# Altium schematic sheet schematic.SchDoc
size C; SheetNumber: 1; SheetTotal: 1; SPICEModelCacheNLUUPGOY: <root> / <DocumentId>NLUUPGOY</DocumentId> / <CacheFrame Number="0"> / <Model Name="umk107bj105_a-t" Kind="CKT"> / <Text>* UMK107BJ105_A-T     SPICE MODEL  ( General Type ) / *-------------------------------------------------------------------------------------------------------- / * Model Generated by TAIYO YUDEN Corporation (http://www.ty-top.com) / * Version 1.0 / * TAIYO YUDEN Control No. 170508_130520 / * Copyright(c) 2012 TAIYO YUDEN CO.,LTD. All Rights Reserved. / *-------------------------------------------------------------------------------------------------------- / * / * Products Name : Multilayer Ceramic Capacitors / * / * Characteristics : / *     Capacitance : 1 uF , Rated Voltage : 50V , TCC : X5R / *     Case Size : 1.6 x 0.8 / 0.063 x 0.031 [mm/inch] , Thickness : 0.8 / 0.031 [mm/inch] / *     (Conditions: Temperature = 25 degC , DC Bias Current/Voltage = 0A / 0V) / * / * Frequency Range : 40Hz - 3GHz / * / * External Node Assignments : / * / *  1  o---| |---o  2 / * / *-------------------------------------------------------------------------------------------------------- / .SubCkt UMK107BJ105_A-T 1 2 / **************************** / C0 1 110 0.79929u / Cm 1 101 0.13681u / C1 101 102 0.26224u / Rc1 101 102 5.8806k / C2 102 103 0.057839u / Rc2 102 103 469.42 / C3 103 110 0.014568u / Rc3 103 110 14.853 / C2m 1 301 0.13283u / C21 301 302 1.2593u / Rc21 301 302 6.3079k / C22 302 303 1.1189u / Rc22 302 303 6.9405k / C23 303 304 1.1421u / Rc23 303 304 6.4848k / C24 304 305 0.36861u / Rc24 304 305 785 / C25 305 306 0.39327u / Rc25 305 306 637.41 / C26 306 307 0.27451u / Rc26 306 307 19.365 / C27 307 308 0.15295u / Rc27 307 308 23.239 / C28 308 309 0.17569u / Rc28 308 309 17.788 / C29 309 110 1420.6p / Rc29 309 110 1.9725 / Rp0 1 110 500Meg / L0 110 120 0.24088n / Lm 120 130 0.1369n / L1 120 121 0.1842n / RL1 121 130 0.29804 / L2 120 122 0.40657n / RL2 122 130 0.57395 / L3 120 123 0.85773n / RL3 123 130 0.82282 / CR 120 124 0.11463u / LR 124 125 0.25983n / RR 125 130 52.447m / CL 130 140 1.4637p / LL 130 140 0.23986n / RL 130 140 33.985 / Rs 140 2 6.8539m / **************************** / .ends UMK107BJ105_A-T</Text> / </Model> / </CacheFrame> / </root>
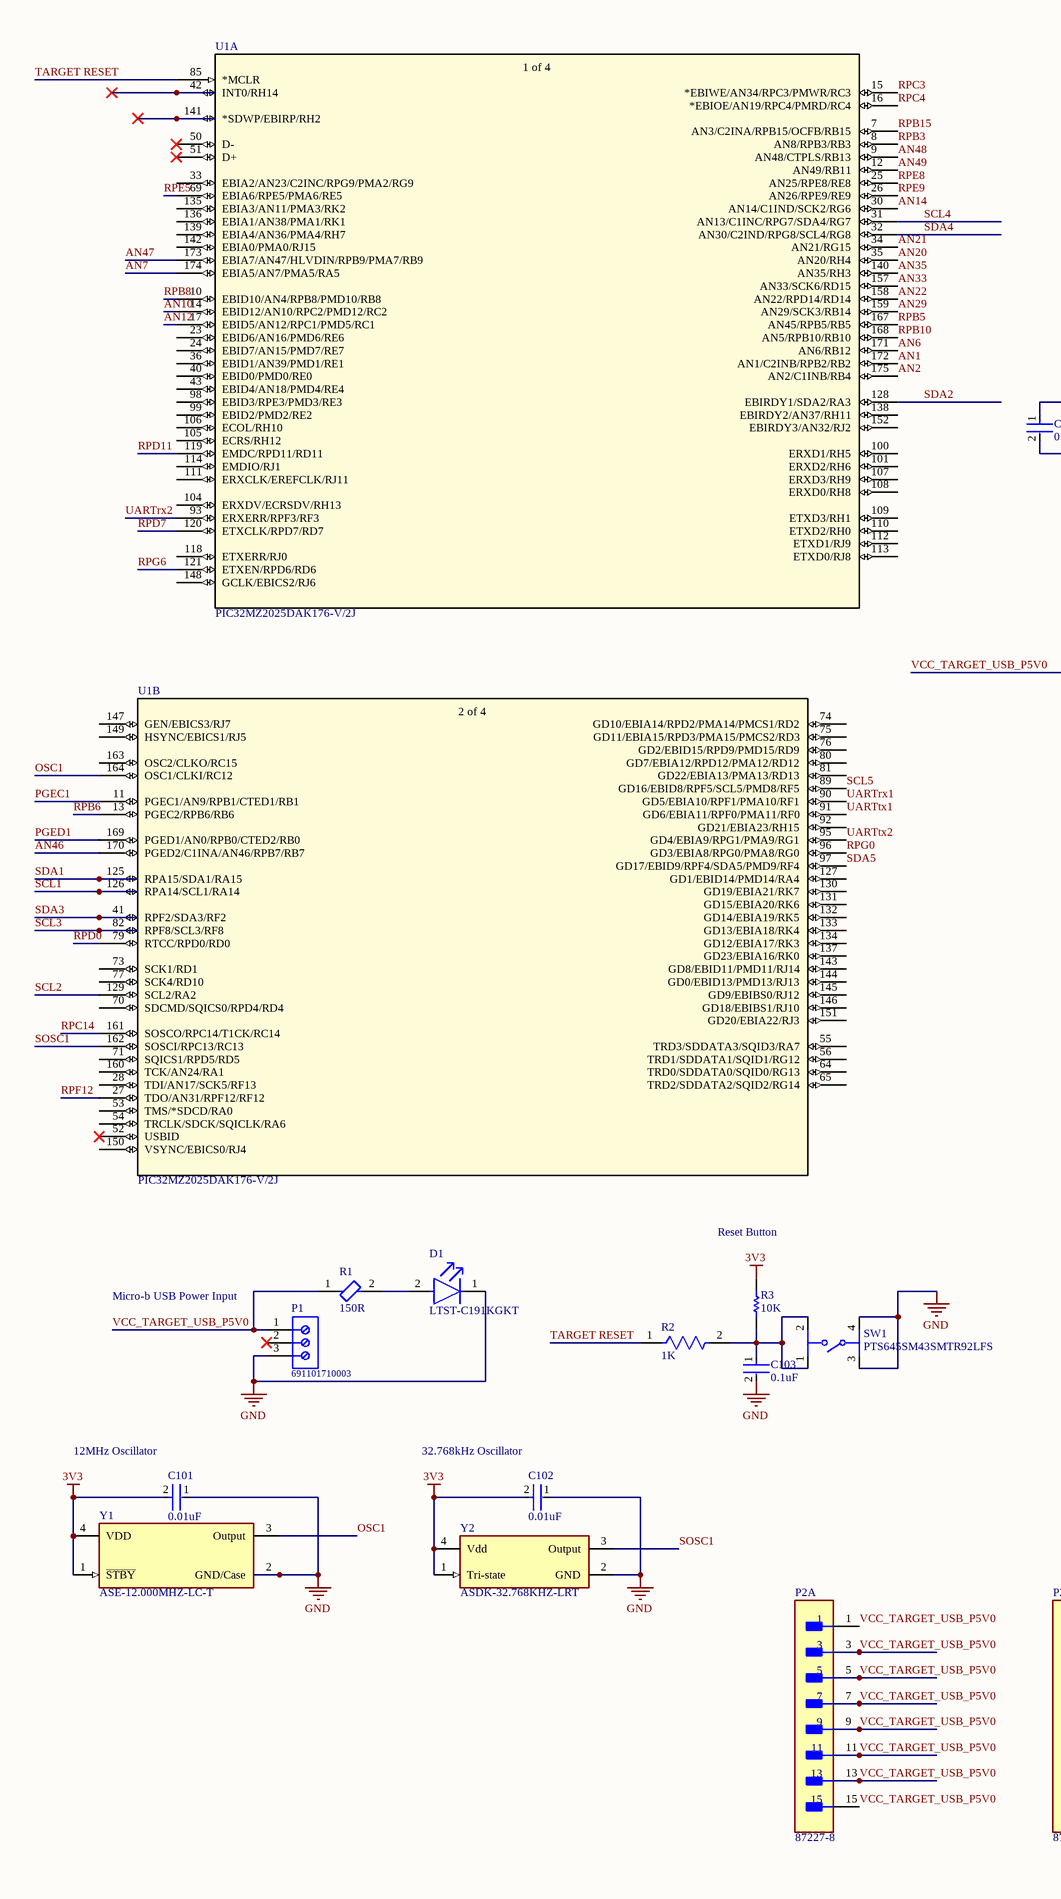
[diagram p0: schematic.SchDoc, left]
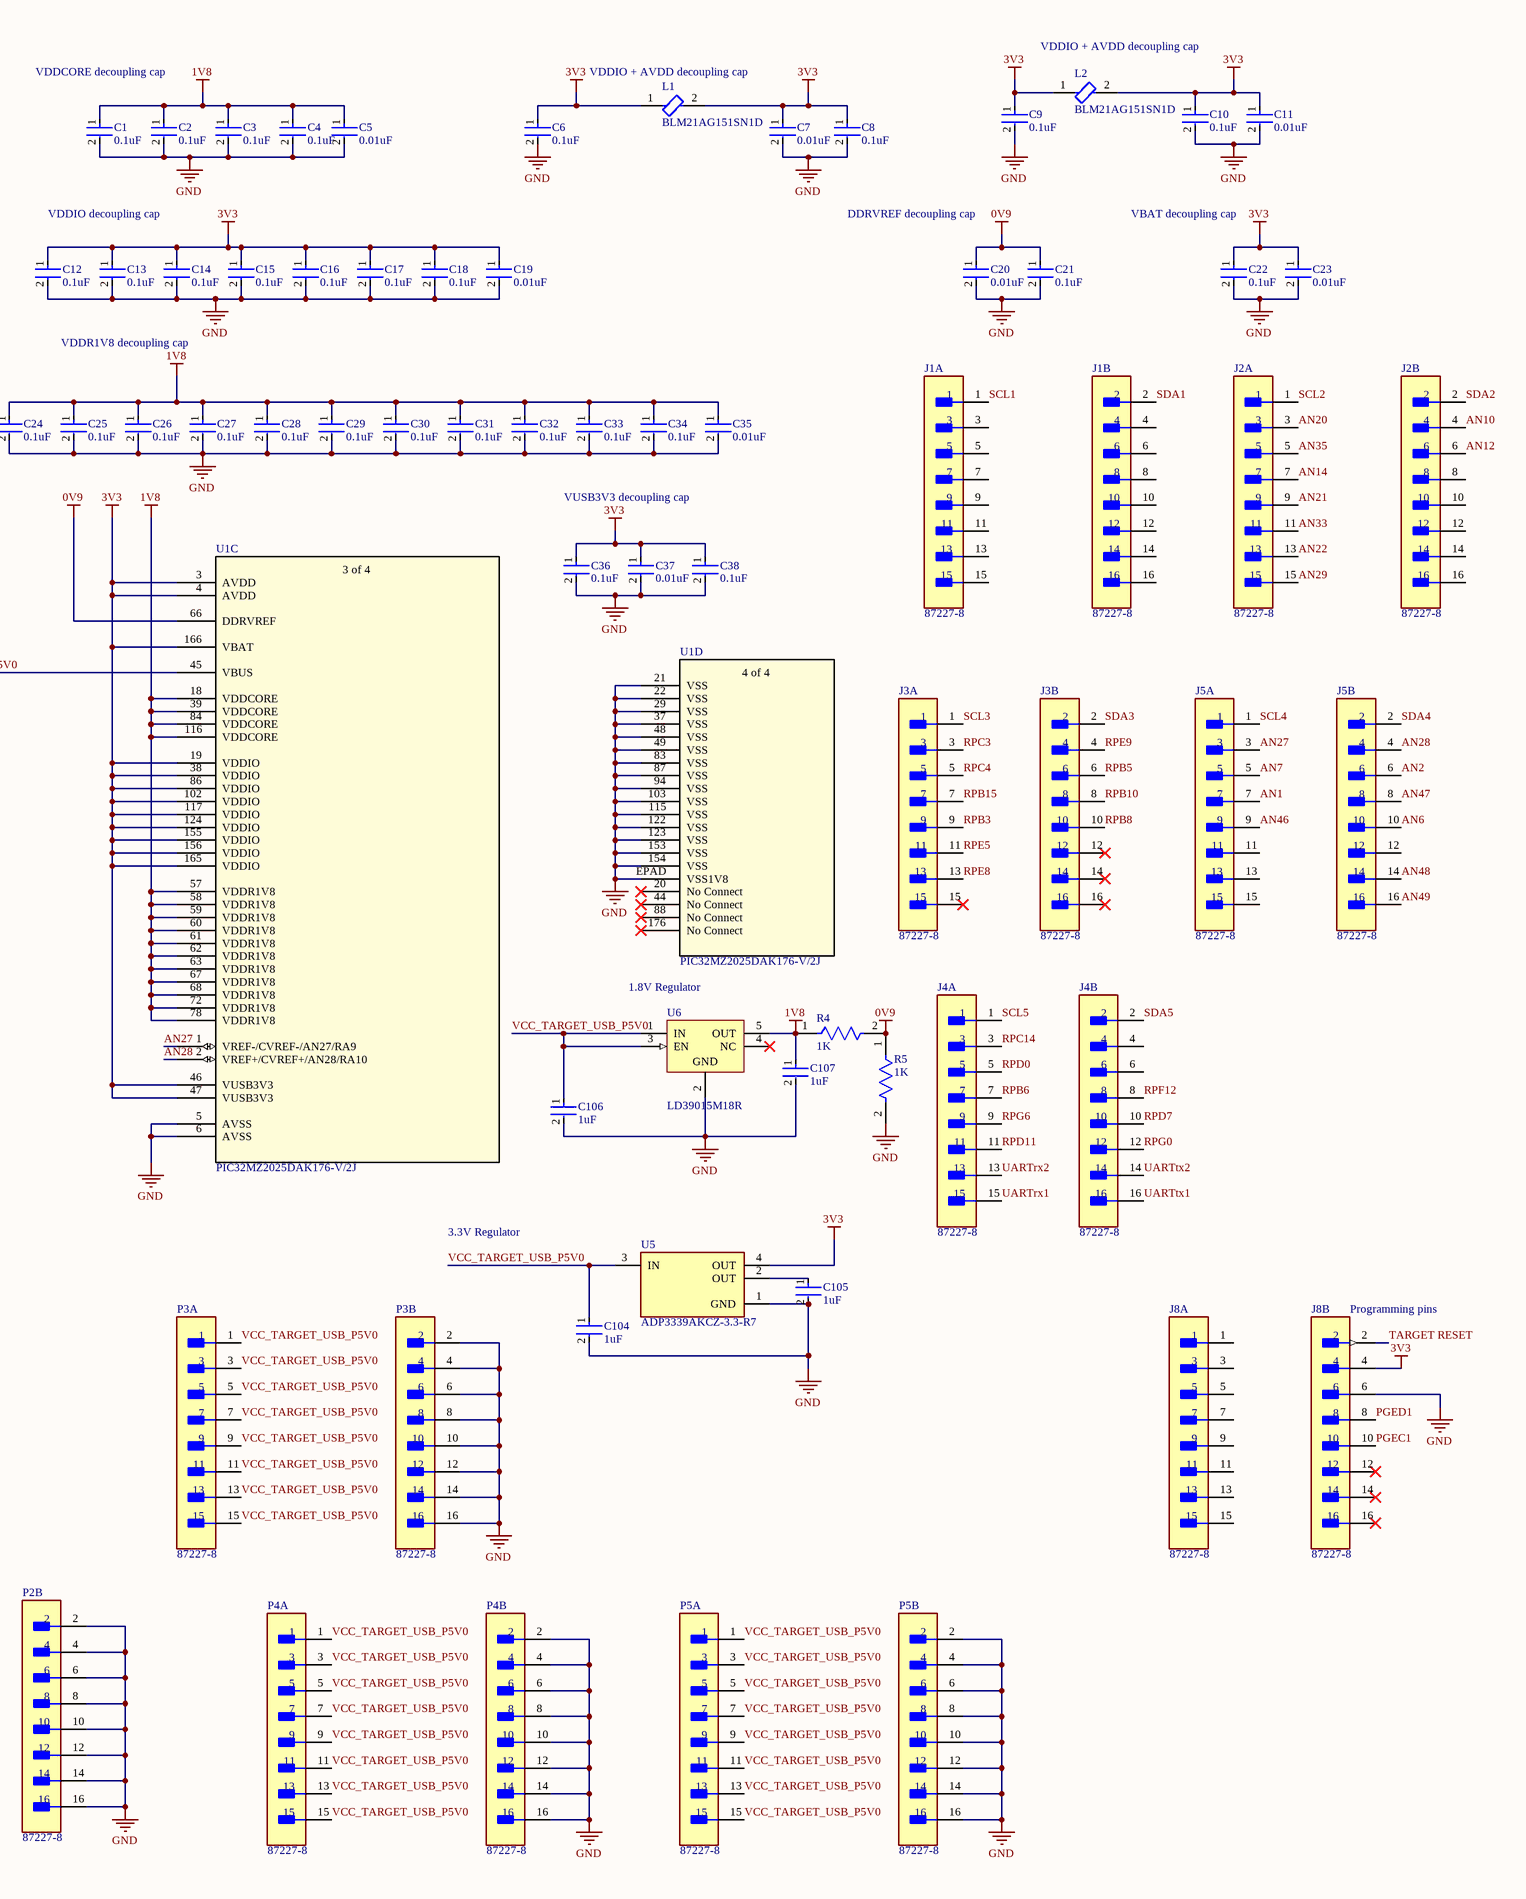
[diagram p1: schematic.SchDoc, right]

## Parts
C1  0.1uF  [FP-CGA2B-MFG]
C2  0.1uF  [FP-CGA2B-MFG]
C3  0.1uF  [FP-CGA2B-MFG]
C4  0.1uF  [FP-CGA2B-MFG]
C5  0.01uF  [FP-C1005-050-0_05-IPC_B]
C6  0.1uF  [FP-CGA2B-MFG]
C7  0.01uF  [FP-C1005-050-0_05-IPC_B]
C8  0.1uF  [FP-CGA2B-MFG]
C9  0.1uF  [FP-CGA2B-MFG]
C10  0.1uF  [FP-CGA2B-MFG]
C11  0.01uF  [FP-C1005-050-0_05-IPC_B]
C12  0.1uF  [FP-CGA2B-MFG]
C13  0.1uF  [FP-CGA2B-MFG]
C14  0.1uF  [FP-CGA2B-MFG]
C15  0.1uF  [FP-CGA2B-MFG]
C16  0.1uF  [FP-CGA2B-MFG]
C17  0.1uF  [FP-CGA2B-MFG]
C18  0.1uF  [FP-CGA2B-MFG]
C19  0.01uF  [FP-C1005-050-0_05-IPC_B]
C20  0.01uF  [FP-C1005-050-0_05-IPC_B]
C21  0.1uF  [FP-CGA2B-MFG]
C22  0.1uF  [FP-CGA2B-MFG]
C23  0.01uF  [FP-C1005-050-0_05-IPC_B]
C24  0.1uF  [FP-CGA2B-MFG]
C25  0.1uF  [FP-CGA2B-MFG]
C26  0.1uF  [FP-CGA2B-MFG]
C27  0.1uF  [FP-CGA2B-MFG]
C28  0.1uF  [FP-CGA2B-MFG]
C29  0.1uF  [FP-CGA2B-MFG]
C30  0.1uF  [FP-CGA2B-MFG]
C31  0.1uF  [FP-CGA2B-MFG]
C32  0.1uF  [FP-CGA2B-MFG]
C33  0.1uF  [FP-CGA2B-MFG]
C34  0.1uF  [FP-CGA2B-MFG]
C35  0.01uF  [FP-C1005-050-0_05-IPC_B]
C36  0.1uF  [FP-CGA2B-MFG]
C37  0.01uF  [FP-C1005-050-0_05-IPC_B]
C38  0.1uF  [FP-CGA2B-MFG]
C101  0.01uF  [FP-C1608-080-0_1-MFG]
C102  0.01uF  [FP-C1608-080-0_1-MFG]
C103  0.1uF  [FP-CGA3E-0_3-0_1-IPC_A]
C104  1uF  [FP-0603-L_1_6_0_1-W_0_8_0-IPC_B]
C105  1uF  [FP-0603-L_1_6_0_1-W_0_8_0-IPC_B]
C106  1uF  [FP-0603-L_1_6_0_1-W_0_8_0-IPC_B]
C107  1uF  [FP-0603-L_1_6_0_1-W_0_8_0-IPC_B]
D1  LTST-C191KGKT  [FP-LTST-C191KGKT-MFG]
J1  87227-8  [FP-87227-8-MFG]  (parts A,B of 2)
J2  87227-8  [FP-87227-8-MFG]  (parts A,B of 2)
J3  87227-8  [FP-87227-8-MFG]  (parts A,B of 2)
J4  87227-8  [FP-87227-8-MFG]  (parts A,B of 2)
J5  87227-8  [FP-87227-8-MFG]  (parts A,B of 2)
J8  87227-8  [FP-87227-8-MFG]  (parts A,B of 2)
L1  BLM21AG151SN1D  [FP-BLM21-0_2-t0_85-e0_5-MFG]
L2  BLM21AG151SN1D  [FP-BLM21-0_2-t0_85-e0_5-MFG]
P1  691101710003  [691101710003]
P2  87227-8  [FP-87227-8-MFG]  (parts A,B of 2)
P3  87227-8  [FP-87227-8-MFG]  (parts A,B of 2)
P4  87227-8  [FP-87227-8-MFG]  (parts A,B of 2)
P5  87227-8  [FP-87227-8-MFG]  (parts A,B of 2)
R1  150R  [FP-BLM18-0_15-t0_8-IPC_B]
R2  1K  [FP-ERJ3G-MFG]
R3  10K  [RESC1609X55X30LL15T15]
R4  1K  [FP-ERJ3G-MFG]
R5  1K  [FP-ERJ3G-MFG]
SW1  PTS645SM43SMTR92LFS  [FP-PTS645SM43SMTR92LFS-MFG]
U1  PIC32MZ2025DAK176-V/2J  [LQFP176_2J_MCH]  (parts A,B,C,D of 4)
U5  ADP3339AKCZ-3.3-R7  [FP-KC-3-IPC_C]
U6  LD39015M18R  [SOT23-5L_M]
Y1  ASE-12.000MHZ-LC-T  [FP-ASE-MFG]
Y2  ASDK-32.768KHZ-LRT  [FP-ASDK-MFG]

## Nets
0V9: C20.1 C21.1 R4.2 R5.1 U1.66(DDRVREF)
1V8: C1.1 C2.1 C3.1 C4.1 C5.1 C24.1 C25.1 C26.1 C27.1 C28.1 C29.1 C30.1 C31.1 C32.1 C33.1 C34.1 C35.1 C107.1 R4.1 U1.18(VDDCORE) U1.39(VDDCORE) U1.57(VDDR1V8) U1.58(VDDR1V8) U1.59(VDDR1V8) U1.60(VDDR1V8) U1.61(VDDR1V8) U1.62(VDDR1V8) U1.63(VDDR1V8) U1.67(VDDR1V8) U1.68(VDDR1V8) U1.72(VDDR1V8) U1.78(VDDR1V8) U1.84(VDDCORE) U1.116(VDDCORE) U6.5(OUT)
3V3: C6.1 C7.1 C8.1 C9.1 C10.1 C11.1 C12.1 C13.1 C14.1 C15.1 C16.1 C17.1 C18.1 C19.1 C22.1 C23.1 C36.1 C37.1 C38.1 C101.2 C102.2 J8.4 L1.1 L1.2 L2.1 L2.2 R3.2 U1.3(AVDD) U1.4(AVDD) U1.19(VDDIO) U1.38(VDDIO) U1.46(VUSB3V3) U1.47(VUSB3V3) U1.86(VDDIO) U1.102(VDDIO) U1.117(VDDIO) U1.124(VDDIO) U1.155(VDDIO) U1.156(VDDIO) U1.165(VDDIO) U1.166(VBAT) U5.4(OUT) Y1.1(~{STBY}) Y1.4(VDD) Y2.1(Tri-state) Y2.4(Vdd)
GND: C1.2 C2.2 C3.2 C4.2 C5.2 C6.2 C7.2 C8.2 C9.2 C10.2 C11.2 C12.2 C13.2 C14.2 C15.2 C16.2 C17.2 C18.2 C19.2 C20.2 C21.2 C22.2 C23.2 C24.2 C25.2 C26.2 C27.2 C28.2 C29.2 C30.2 C31.2 C32.2 C33.2 C34.2 C35.2 C36.2 C37.2 C38.2 C101.1 C102.1 C103.2 C104.2 C105.2 C106.2 C107.2 D1.1(C) J8.6 P1.3 P2.2 P2.4 P2.6 P2.8 P2.10 P2.12 P2.14 P2.16 P3.2 P3.4 P3.6 P3.8 P3.10 P3.12 P3.14 P3.16 P4.2 P4.4 P4.6 P4.8 P4.10 P4.12 P4.14 P4.16 P5.2 P5.4 P5.6 P5.8 P5.10 P5.12 P5.14 P5.16 R5.2 SW1.3 SW1.4 U1.5(AVSS) U1.6(AVSS) U1.21(VSS) U1.22(VSS) U1.29(VSS) U1.37(VSS) U1.48(VSS) U1.49(VSS) U1.83(VSS) U1.87(VSS) U1.94(VSS) U1.103(VSS) U1.115(VSS) U1.122(VSS) U1.123(VSS) U1.153(VSS) U1.154(VSS) U1.EPAD(VSS1V8) U5.1(GND) U6.2(GND) Y1.2(GND/Case) Y2.2(GND)
AN1: J5.7 U1.172(AN1/C2INB/RPB2/RB2)
AN2: J5.6 U1.175(AN2/C1INB/RB4)
AN6: J5.10 U1.171(AN6/RB12)
AN7: J5.5 U1.174(EBIA5/AN7/PMA5/RA5)
AN10: J2.4 U1.14(EBID12/AN10/RPC2/PMD12/RC2)
AN12: J2.6 U1.17(EBID5/AN12/RPC1/PMD5/RC1)
AN14: J2.7 U1.30(AN14/C1IND/SCK2/RG6)
AN20: J2.3 U1.35(AN20/RH4)
AN21: J2.9 U1.34(AN21/RG15)
AN22: J2.13 U1.158(AN22/RPD14/RD14)
AN27: J5.3 U1.1(VREF-/CVREF-/AN27/RA9)
AN28: J5.4 U1.2(VREF+/CVREF+/AN28/RA10)
AN29: J2.15 U1.159(AN29/SCK3/RB14)
AN33: J2.11 U1.157(AN33/SCK6/RD15)
AN35: J2.5 U1.140(AN35/RH3)
AN46: J5.9 U1.170(PGED2/C1INA/AN46/RPB7/RB7)
AN47: J5.8 U1.173(EBIA7/AN47/HLVDIN/RPB9/PMA7/RB9)
AN48: J5.14 U1.9(AN48/CTPLS/RB13)
AN49: J5.16 U1.12(AN49/RB11)
OSC1: U1.164(OSC1/CLKI/RC12) Y1.3(Output)
PGEC1: J8.10 U1.11(PGEC1/AN9/RPB1/CTED1/RB1)
PGED1: J8.8 U1.169(PGED1/AN0/RPB0/CTED2/RB0)
RPB3: J3.9 U1.8(AN8/RPB3/RB3)
RPB5: J3.6 U1.167(AN45/RPB5/RB5)
RPB6: J4.7 U1.13(PGEC2/RPB6/RB6)
RPB8: J3.10 U1.10(EBID10/AN4/RPB8/PMD10/RB8)
RPB10: J3.8 U1.168(AN5/RPB10/RB10)
RPB15: J3.7 U1.7(AN3/C2INA/RPB15/OCFB/RB15)
RPC3: J3.3 U1.15(*EBIWE/AN34/RPC3/PMWR/RC3)
RPC4: J3.5 U1.16(*EBIOE/AN19/RPC4/PMRD/RC4)
RPC14: J4.3 U1.161(SOSCO/RPC14/T1CK/RC14)
RPD0: J4.5 U1.79(RTCC/RPD0/RD0)
RPD7: J4.10 U1.120(ETXCLK/RPD7/RD7)
RPD11: J4.11 U1.119(EMDC/RPD11/RD11)
RPE5: J3.11 U1.69(EBIA6/RPE5/PMA6/RE5)
RPE8: J3.13 U1.25(AN25/RPE8/RE8)
RPE9: J3.4 U1.26(AN26/RPE9/RE9)
RPF12: J4.8 U1.27(TDO/AN31/RPF12/RF12)
RPG0: J4.12 U1.96(GD3/EBIA8/RPG0/PMA8/RG0)
RPG6: J4.9 U1.121(ETXEN/RPD6/RD6)
SCL1: J1.1 U1.126(RPA14/SCL1/RA14)
SCL2: J2.1 U1.129(SCL2/RA2)
SCL3: J3.1 U1.82(RPF8/SCL3/RF8)
SCL4: J5.1 U1.31(AN13/C1INC/RPG7/SDA4/RG7)
SCL5: J4.1 U1.89(GD16/EBID8/RPF5/SCL5/PMD8/RF5)
SDA1: J1.2 U1.125(RPA15/SDA1/RA15)
SDA2: J2.2 U1.128(EBIRDY1/SDA2/RA3)
SDA3: J3.2 U1.41(RPF2/SDA3/RF2)
SDA4: J5.2 U1.32(AN30/C2IND/RPG8/SCL4/RG8)
SDA5: J4.2 U1.97(GD17/EBID9/RPF4/SDA5/PMD9/RF4)
SOSC1: U1.162(SOSCI/RPC13/RC13) Y2.3(Output)
TARGET RESET: J8.2 R2.1 U1.85(*MCLR)
UARTrx1: J4.15 U1.90(GD5/EBIA10/RPF1/PMA10/RF1)
UARTrx2: J4.13 U1.93(ERXERR/RPF3/RF3)
UARTtx1: J4.16 U1.91(GD6/EBIA11/RPF0/PMA11/RF0)
UARTtx2: J4.14 U1.95(GD4/EBIA9/RPG1/PMA9/RG1)
VCC_TARGET_USB_P5V0: C104.1 C106.1 P1.1 P2.1 P2.3 P2.5 P2.7 P2.9 P2.11 P2.13 P2.15 P3.1 P3.3 P3.5 P3.7 P3.9 P3.11 P3.13 P3.15 P4.1 P4.3 P4.5 P4.7 P4.9 P4.11 P4.13 P4.15 P5.1 P5.3 P5.5 P5.7 P5.9 P5.11 P5.13 P5.15 R1.1 U1.45(VBUS) U5.3(IN) U6.1(IN) U6.3(EN)
NetC103_1: C103.1 R2.2 R3.1 SW1.1 SW1.2
NetC105_1: C105.1 U5.2(OUT)
NetD1_2: D1.2(A) R1.2

Not connected (* = marked no-connect by the designer): J1 3 4 5 6 7 8 9 10 11 12 13 14 15 16; J2 8 10 12 14 16; J3 12* 14* 15* 16*; J4 4 6; J5 11 12 13 15; J8 1 3 5 7 9 11 12* 13 14* 15 16*; P1 2*; U1 20(No_Connect)* 23(EBID6/AN16/PMD6/RE6) 24(EBID7/AN15/PMD7/RE7) 28(TDI/AN17/SCK5/RF13) 33(EBIA2/AN23/C2INC/RPG9/PMA2/RG9) 36(EBID1/AN39/PMD1/RE1) 40(EBID0/PMD0/RE0) 42(INT0/RH14)* 43(EBID4/AN18/PMD4/RE4) 44(No_Connect)* 50(D-)* 51(D+)* 52(USBID)* 53(TMS/*SDCD/RA0) 54(TRCLK/SDCK/SQICLK/RA6) 55(TRD3/SDDATA3/SQID3/RA7) 56(TRD1/SDDATA1/SQID1/RG12) 64(TRD0/SDDATA0/SQID0/RG13) 65(TRD2/SDDATA2/SQID2/RG14) 70(SDCMD/SQICS0/RPD4/RD4) 71(SQICS1/RPD5/RD5) 73(SCK1/RD1) 74(GD10/EBIA14/RPD2/PMA14/PMCS1/RD2) 75(GD11/EBIA15/RPD3/PMA15/PMCS2/RD3) 76(GD2/EBID15/RPD9/PMD15/RD9) 77(SCK4/RD10) 80(GD7/EBIA12/RPD12/PMA12/RD12) 81(GD22/EBIA13/PMA13/RD13) 88(No_Connect)* 92(GD21/EBIA23/RH15) 98(EBID3/RPE3/PMD3/RE3) 99(EBID2/PMD2/RE2) 100(ERXD1/RH5) 101(ERXD2/RH6) 104(ERXDV/ECRSDV/RH13) 105(ECRS/RH12) 106(ECOL/RH10) 107(ERXD3/RH9) 108(ERXD0/RH8) 109(ETXD3/RH1) 110(ETXD2/RH0) 111(ERXCLK/EREFCLK/RJ11) 112(ETXD1/RJ9) 113(ETXD0/RJ8) 114(EMDIO/RJ1) 118(ETXERR/RJ0) 127(GD1/EBID14/PMD14/RA4) 130(GD19/EBIA21/RK7) 131(GD15/EBIA20/RK6) 132(GD14/EBIA19/RK5) 133(GD13/EBIA18/RK4) 134(GD12/EBIA17/RK3) 135(EBIA3/AN11/PMA3/RK2) 136(EBIA1/AN38/PMA1/RK1) 137(GD23/EBIA16/RK0) 138(EBIRDY2/AN37/RH11) 139(EBIA4/AN36/PMA4/RH7) 141(*SDWP/EBIRP/RH2)* 142(EBIA0/PMA0/RJ15) 143(GD8/EBID11/PMD11/RJ14) 144(GD0/EBID13/PMD13/RJ13) 145(GD9/EBIBS0/RJ12) 146(GD18/EBIBS1/RJ10) 147(GEN/EBICS3/RJ7) 148(GCLK/EBICS2/RJ6) 149(HSYNC/EBICS1/RJ5) 150(VSYNC/EBICS0/RJ4) 151(GD20/EBIA22/RJ3) 152(EBIRDY3/AN32/RJ2) 160(TCK/AN24/RA1) 163(OSC2/CLKO/RC15) 176(No_Connect)*; U6 4(NC)*

## Notes on the sheet
- VDDCORE decoupling cap
- (near L1) VDDIO + AVDD decoupling cap
- VDDIO + AVDD decoupling cap
- VDDIO decoupling cap
- DDRVREF decoupling cap
- VBAT decoupling cap
- VDDR1V8 decoupling cap
- VUSB3V3 decoupling cap
- 1.8V Regulator
- Reset Button
- 3.3V Regulator
- Micro-b USB Power Input
- (near J8) Programming pins
- (near C101) 12MHz Oscillator
- (near C102) 32.768kHz Oscillator
- (in symbol PIC32MZ2025DAK176-V/2J, part A) 1 of 4
- (in symbol PIC32MZ2025DAK176-V/2J, part B) 2 of 4
- (in symbol PIC32MZ2025DAK176-V/2J, part C) 3 of 4
- (in symbol PIC32MZ2025DAK176-V/2J, part D) 4 of 4

## Library data of the parts
C1-C4 C6 C8-C10 C12-C18 C21 C22 C24-C34 C36 C38 = CMP-2000-05004-3: Cap Ceramic 100nF 50V X7R 10% Pad SMD 0402 +125°C Automotive T/R; Min Operating Temperature: -55°C; Packaging: Tape and Reel; Voltage Rating (DC): 50V; Package Quantity: 1; Ratings: AEC-Q200; Width: 0.02inch; Max Operating Temperature: 125°C; Weight: 2.3E-05oz; Capacitance: 100nF; Case Code (Metric): 1005; Mount: Surface Mount; Termination: SMD/SMT; REACH SVHC: No SVHC; Length: 1mm; Voltage: 50V; Voltage Rating: 50V; Case Code (Imperial): 0402; Thickness: 0.022inch; Dielectric: X7R; Lead Free: Lead Free; Depth: 0.5mm; Composition: Ceramic; Case/Package: 0402; Tolerance: 10%; Height: 0.5mm
C5 C7 C11 C19 C20 C23 C35 C37 = CMP-08246-003410-1: Multilayer Ceramic Capacitors 10nF ±20% 50V X5R SMD 0402; Voltage Rating (DC): 50V; Capacitance: 10nF; Series: C; Dielectric Material: Ceramic; Termination: SMD/SMT; Case Code (Imperial): 0402; Max Operating Temperature: 85°C; Case Code (Metric): 1005; Weight: 0.001199oz; Height: 0.5mm; Mount: Surface Mount; Length: 0.039inch; Voltage Rating: 50V; Packaging: Tape and Reel; Tolerance: 20%; Case/Package: 0402; Width: 0.02inch; Dielectric: X5R; Package Quantity: 10000; Thickness: 0.022inch; RoHS Compliant: Yes; Min Operating Temperature: -55°C; Lead Free: Lead Free; Resistor Type: Ceramic
C101 C102 = CMP-2000-06026-2: Multilayer Ceramic Capacitors 10nF ±10% 50V X7R SMD 0603; Voltage: 50V; Depth: 0.8mm; REACH SVHC: No SVHC; Packaging: Tape and Reel; Dielectric Material: Ceramic; Dielectric: X7R; Min Operating Temperature: -55°C; Package Quantity: 1; Width: 0.031inch; Case Code (Imperial): 0603; Radiation Hardening: No; Length: 1.6mm; RoHS Compliant: Yes; Tolerance: 10%; Termination: SMD/SMT; Mount: Surface Mount; Construction: Flat; Resistor Type: Ceramic; Max Operating Temperature: 125°C; Series: C; Lead Free: Lead Free; Capacitance: 10nF; Voltage Rating (DC): 50V; Thickness: 0.037inch; Voltage Rating: 50V; Height: 0.8mm; Weight: 7.1E-05oz; Case/Package: 0603; Case Code (Metric): 1608
C103 = CMP-2000-07546-2: Cap Ceramic 100nF 50V X7R 10% Pad SMD 0603 +125°C Automotive T/R; Weight: 7.1E-05oz; Composition: Ceramic; Max Operating Temperature: 125°C; Termination: SMD/SMT; Dielectric: X7R; Length: 1.6mm; Package Quantity: 1; REACH SVHC: No SVHC; Lead Free: Lead Free; Case Code (Metric): 1608; Min Operating Temperature: -55°C; Packaging: Tape and Reel; Tolerance: 10%; Voltage Rating: 50V; Case Code (Imperial): 0603; Capacitance: 100nF; Case/Package: 0603; Voltage Rating (DC): 50V; Depth: 0.8mm; Radiation Hardening: No; Ratings: AEC-Q200; Mount: Surface Mount; Voltage: 50V; Thickness: 0.035inch; Width: 0.8mm; Height: 0.8mm
C104-C107 = CMP-2000-05447-3: None; Tolerance: 10%; Voltage Rating: 50V; Dielectric: X5R; Height: 0.8mm; Depth: 0.8mm; Number of Pins: 2; Length: 1.6mm; Thickness: 0.035inch; Contact Plating: Nickel; Radiation Hardening: No; Package Quantity: 1; Case/Package: 0603; Capacitance: 1uF; Halogen Free: Halogen Free; RoHS Compliant: Yes; Termination: SMD/SMT; Max Operating Temperature: 85°C; Min Operating Temperature: -55°C; Case Code (Metric): 1608; Construction: Flat; Voltage Rating (DC): 50V; Packaging: Tape and Reel; Series: M; Case Code (Imperial): 0603; Width: 0.031inch; Mount: Surface Mount
D1 = CMP-2000-05198-2: LED GREEN CLEAR SMD; Max Power Dissipation: 75mW; Forward Current: 30mA; Reverse Voltage: 5V; Lens Color: Colorless; Forward Voltage: 2V; Dominant Wavelength: 571nm; Number of LEDs: 1; Viewing Angle: 130°; Lens Style: Rectangular; Test Current: 20mA; Luminous Intensity: 35mcd; Wavelength: 574nm; Width: 0.8mm; Case Code (Imperial): 0603; Number of Pins: 2; Lead Free: Lead Free; Packaging: Tape and Reel; Package Quantity: 1; Min Operating Temperature: -55°C; Case/Package: 0603; Length: 1.6mm; Power Dissipation: 75mW; Depth: 0.8mm; Radiation Hardening: No; Mount: Surface Mount; Max Operating Temperature: 85°C; Color: Green; Power Rating: 75mW; Height: 0.55mm; Illumination Color: Green; Case Code (Metric): 1608; Lens Transparency: Clear; Number of Elements: 1
J1-J5 J8 P2-P5 = CMP-03369-000064-1: CONN HEADER VERT 16POS 2.54MM; Manufacturer: TE Connectivity; Conn Gender: Male; Conn Orientation: Straight; Current Rating: 3A; Number Of Contacts: 16; Mouser Description: Headers & Wire Housings UNSHRD VERT DUAL 16; Lead Free: Yes; Digikey Description: CONN HEADER VERT 16POS 2.54MM; Device Class L3: unset; Automotive: No; Height: 0.428inch; Temperature Range Low: -65°C; Device Class L1: Connectors; RoHS: TRUE; Pitch: 2.54mm; Package: 0; Manufacturer Part Number: 87227-8; Number Of Rows: 2; Footprint Url: https://www.te.com/commerce/DocumentDelivery/DDEController?Action=showdoc&DocId=Customer+Drawing%7F87227%7FH4%7Fpdf%7FEnglish%7FENG_CD_87227_H4.pdf%7F87227-8; ComponentLink2URL: https://www.te.com/usa-en/product-87227-8.datasheet.pdf; ComponentLink2Description: Datasheet; Temperature: -65°C to +105°C; Category: Conn; Temperature Range High: +105°C; Octopart: https://octopart.com/87227-8-te+connectivity-39407754; Device Class L2: Headers and Wire Housings; Contact Material: Gold,Nickel
L1 L2 = CMP-0686-00717-3: Chip Ferrite Bead, 0805, 150Ω @ 100MHz, 0.09Ω, 25%, 1A; Number of Circuits: 1; Max Current Rating: 800mA; DC Resistance (DCR): 100mR; Shielding: Unshielded; DC Current: 200mA; Impedance: 150R; Contact Plating: Tin; Weight: 0.000194oz; Series: EMIFIL®, BLM21A; Core Material: Ferrite; Test Frequency: 100MHz; Case Code (Metric): 2012; Package Quantity: 4000; Lead Free: Lead Free; Max Operating Temperature: 125°C; Case Code (Imperial): 0805; Material: Ferrite; Min Operating Temperature: -55°C; Tolerance: 25%; Length: 2mm; DC Resistance-Max: 100mR; Width: 1.25mm; RoHS Compliant: Yes; Packaging: Tape and Reel; REACH SVHC: No SVHC; Depth: 1.45mm; Number of Pins: 2; Radiation Hardening: No; Current Rating: 800mA; Height: 0.85mm; Termination: SMD/SMT; Number of Lines: 1; Max DC Current: 200mA; Case/Package: 0805
P1 = CMP-1502-03257-1: Series 101 - 5.00 mm Horizontal Entry Modular with Pressure Clamp WR-TBL, 3 pin; Manufacturer: Wurth Elektronik; Pitch: 5.00mm; Pin Number: 3; Publisher: WurthElektronik; Part Number: 691101710003; Operating Temperature: -40to105degC; Package Reference: 691101710003; Packaging: Box; Manufacturer URL: http://www.we-online.de; Datasheet URL: http://katalog.we-online.de/em/datasheet/6911017100xx.pdf; Mounting Technology: THT
R1 = CMP-0686-00448-3: Chip Ferrite Bead, 0603, 150Ω @ 100MHz, 0.4Ω, 25%, 300mA; Current Rating: 200mA; Number of Circuits: 1; Resistance: 400mR; Shielding: Unshielded; Package Quantity: 1; Packaging: Tape and Reel; Case Code (Imperial): 0603; Termination: SMD/SMT; Material: Ferrite; Depth: 0.95mm; Core Material: Ferrite; Series: BLM18B; DC Resistance (DCR): 400mR; Min Operating Temperature: -55°C; Height: 0.8mm; Case/Package: 0603; Max Operating Temperature: 125°C; Max Current Rating: 300mA; Test Frequency: 100MHz; Tolerance: 25%; REACH SVHC: No SVHC; Max DC Current: 200mA; Number of Pins: 2; Number of Lines: 1; Case Code (Metric): 1608; Width: 0.8mm; Length: 1.6mm; Impedance: 150R
R2 R4 R5 = CMP-2000-00703-2: RES SMD 1K OHM 5% 1/10W 0603; Manufacturer: Panasonic; Manufacturer Part Number: ERJ-3GEYJ102V; Resistance: 1000Ω; Voltage: 75 V; Power Rating: 0.1W; Temperature Coefficient: 200ppm/°C; Voltage Rating: 75V; Value: 1000Ω; Automotive Grade: Grade 0; Category: Res; Ipc Land Pattern Name: RESC16080X45; Mounting Type: surface mount; Octopart: https://octopart.com/erj-3geyj102v-panasonic-55403670; Automotive: Yes; Temperature: -55°C to +155°C; ComponentLink2Description: Datasheet; Lead Free: Yes; Footprint Url: https://industrial.panasonic.com/cdbs/www-data/pdf/RDA0000/DMA0000COL17.pdf; Tolerance: 5%; Device Class L1: Passive Components; Height: 0.55mm; Temperature Range Low: -55°C; RoHS: TRUE; Package: ERJ3G; ComponentLink2URL: https://industrial.panasonic.com/cdbs/www-data/pdf/RDA0000/AOA0000C301.pdf; Temperature Range High: +155°C; Digikey Description: RES SMD 1K OHM 5% 1/10W 0603; Series: ERJ; Device Class L2: Resistors; Device Class L3: Chip SMD Resistors; Mouser Description: Res Thick Film 0603 1K Ohm 5% 1/10W ±200ppm/°C Molded SMD Punched Carrier T/R; Composition: Thick Film
R3 = CMP-1012-00623-3: Chip Resistor, 10 KOhm, +/- 1%, 0.1 W, -55 to 155 degC, 0603 (1608 Metric), RoHS, Tape and Reel; Manufacturer: Panasonic; Voltage Rating: 75V; Case\/Package: 0603; Power Rating: 100mW; Resistance: 10KOhm; Temperature Coefficient: 100ppm\/degreesC; Number of Pins: 2; Package Reference: 603; Depth: 0.8mm; Mount: SurfaceMount; Package Description: 2-Pin Surface Mount Device, Body 1.6 x 0.85 mm; Datasheet Version: 02/2017; Length: 1.6mm; Lead Free: LeadFree; Height: 0.45mm; Number of Terminations: 2; Max Power Dissipation: 100mW; Min Operating Temperature: -55degC; Datasheet URL: https://industrial.panasonic.com/cdbs/www-data/pdf/RDA0000/AOA0000C304.pdf; Termination: SMD/SMT; Case Code (Metric): 1608; Case Code (Imperial): 0603; Tolerance: 1%; Max Operating Temperature: 155degC; RoHSCompliant: true; Voltage Rating (DC): 75V; Radiation Hardening: No; Packaging: TapeandReel; Composition: ThickFilm; Mounting Technology: SurfaceMount; Manufacturer URL: http://www.panasonic.com/; Width: 0.031inch; REACH SVHC: NoSVHC; Contact Plating: Tin; Military Standard: Not; Package Quantity: 1
SW1 = CMP-2000-05160-2: SWITCH TACTILE SPST-NO 0.05A 12V; Contact Resistance: 100mR; Throw Configuration: SPST; Illumination Type: Non-Illuminated; Mechanical Life: 100000Cycles; Current Rating: 50mA; Switch Function: Off-Mom; Actuator Length: 0.85mm; Actuator Material: Nylon; Actuator Type: Standard; Operating Force: 160gf; Min Operating Temperature: -20°C; REACH SVHC: No SVHC; Termination: Gull Wing; Case/Package: SMD/SMT; Packaging: Tape and Reel; Mount: Surface Mount; Voltage Rating (DC): 12V; Orientation: Straight; Lead Free: Lead Free; Contact Material: Silver; Color: Black; Max Current Rating: 50mA; Contact Plating: Silver; Depth: 9mm; Package Quantity: 1; Max Voltage Rating (DC): 12V; Length: 6mm; Max Operating Temperature: 60°C
U1 = PIC32MZ2025DAK176-V/2J: No Description Available; Mfr_Name: Microchip; Copyright: Copyright (C) 2022 Ultra Librarian. All rights reserved.; Manufacturer_Part_Number: PIC32MZ2025DAK176-V/2J; RefDes: RefDes; Type: DEV
U5 = CMP-0786-00156-2: IC REG LINEAR 3.3V 1.5A SOT223-3; Number of Outputs: 1; Output Voltage Accuracy: 0.9%; Max Input Voltage: 6V; Max Supply Current: 40mA; Min Input Voltage: 2.8V; Min Output Voltage: 1.5V; Polarity: Positive; Quiescent Current: 130uA; Dropout Voltage: 230mV; Power Supply Rejection Ratio (PSRR): 88dB; Max Output Voltage: 5V; Output Type: Fixed; Min Operating Temperature: -40°C; Package Quantity: 500; Max Output Current: 1.5A; Max Operating Temperature: 85°C; Number of Regulators: 1; Height: 1.6mm; Accuracy: 0.9%; Case/Package: SOT-223; Number of Pins: 3; Operating Supply Current: 40mA; Nominal Output Voltage: 3.3V; Lead Free: Contains Lead; Output Voltage: 3.3V; Packaging: Tape and Reel; REACH SVHC: No SVHC; Output Current: 1.5A; Width: 3.5mm; Length: 6.5mm; Radiation Hardening: No
U6 = CMP-0244-00346-1: 150 mA Low Quiescent Current Low Noise Voltage Regulator, 1.8V, 5-Pin SOT-23, Tape and Reel; ComponentLink1URL: http://www.st.com; PackageReference: SOT23-5L; PackageDescription: 5-Pin SOT-23 Package, 2.9 x 1.6 mm Body, 0.95 mm Pitch, 2.8 mm Lead Span; PackageVersion: 1/01/2008; ComponentLink2URL: http://www.st.com/internet/com/TECHNICAL_RESOURCES/TECHNICAL_LITERATURE/DATASHEET/CD00173477.pdf; ComponentLink2Description: Datasheet; DatasheetVersion: 1/02/2009; ComponentLink1Description: Manufacturer URL
Y1 = CMP-27762-006076-1: XTAL Oscillator 12MHz ±50ppm CMOS 3.3V 4-SMD 3.2mm x 2.5mm; Load Capacitance: 15pF; Min Supply Voltage: 3.135V; Max Supply Current: 7mA; Max Supply Voltage: 3.465V; Series: ASE; Number of Pins: 4; Operating Frequency: 12 MHz; Operating Supply Voltage: 3.3V; Packaging: Tape and Reel; Package Quantity: 1000; Lead Free: Lead Free; REACH SVHC: No SVHC; Max Operating Temperature: 85°C; Frequency: 12MHz; Height: 0.047inch; Frequency Stability: 50ppm; Length: 3.2mm; Width: 0.098inch; Radiation Hardening: No; Mount: Surface Mount; Termination: SMD/SMT; Depth: 2.5mm; Case/Package: SMD/SMT; Min Operating Temperature: -40°C
Y2 = CMP-27762-001115-1: XTAL OSC XO 32.7680KHZ CMOS SMD; Load Capacitance: 15pF; Max Supply Current: 3.5mA; Min Supply Voltage: 2.97V; Operating Supply Voltage: 3.3V; Frequency Stability: 25ppm; Lead Free: Lead Free; Case/Package: CSMD; Number of Pins: 4; Max Operating Temperature: 85°C; Packaging: Tape and Reel; Width: 0.079inch; Min Operating Temperature: -40°C; Radiation Hardening: No; Length: 2.5mm; Depth: 2mm; Termination: SMD/SMT; Height: 0.037inch; Series: ASDK; Frequency: 32.768kHz; Mount: Surface Mount